# Altium project 6_Layer_Signal_Board.PrjPcb (part 2 of 2)

## Sheet AD.SchDoc
size A2; Organization: Protel International P/L; Address1: L3, 12a Rodborough Rd; Address2: Frenchs Forest; Address3: NSW; Address4: Australia 2086
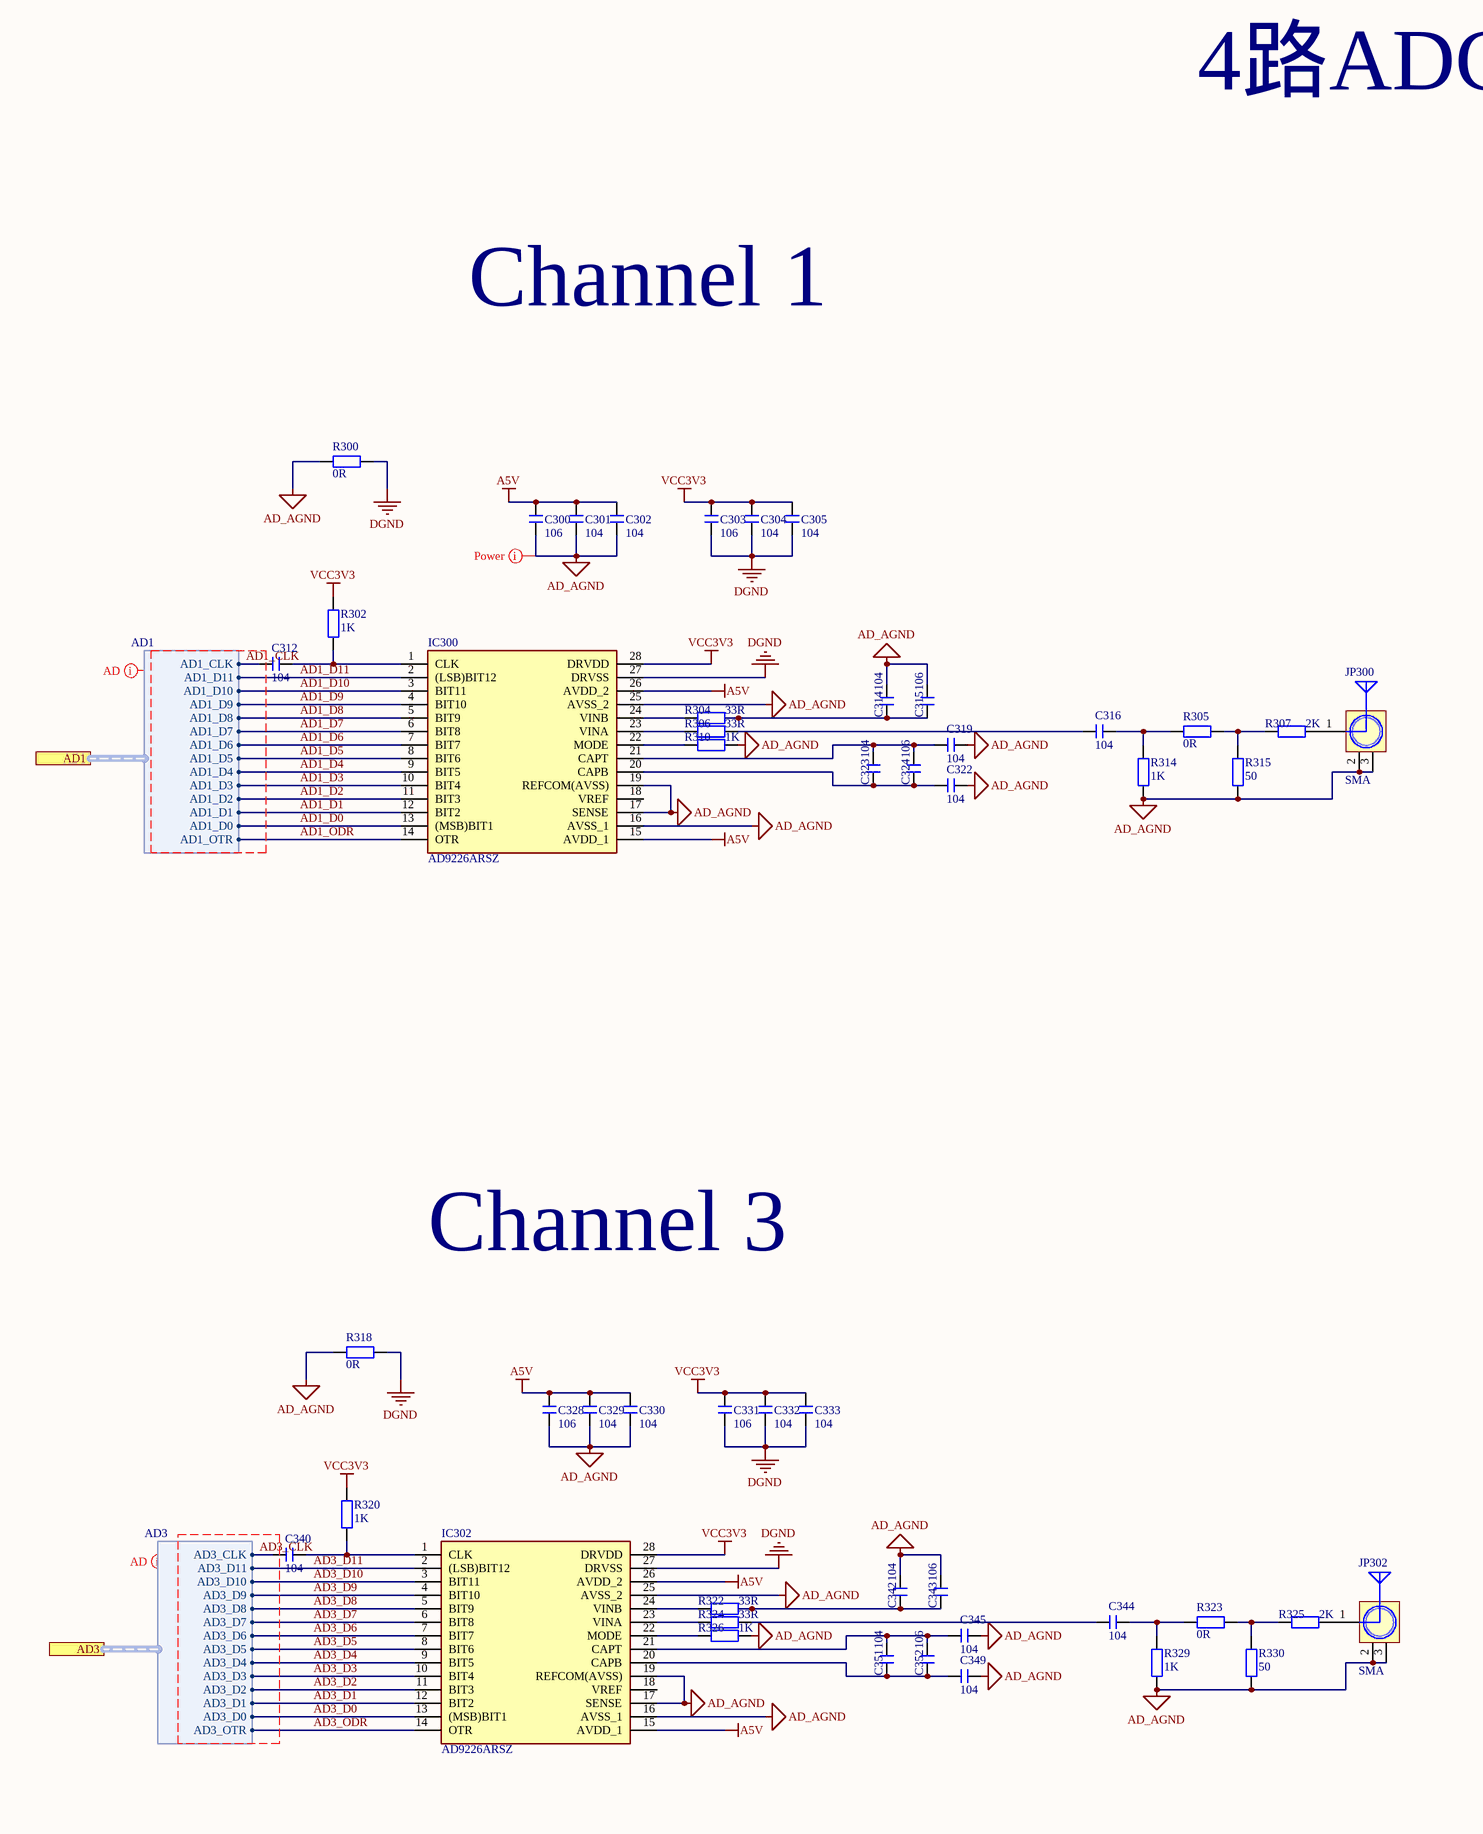
[diagram p11: AD.SchDoc, left]
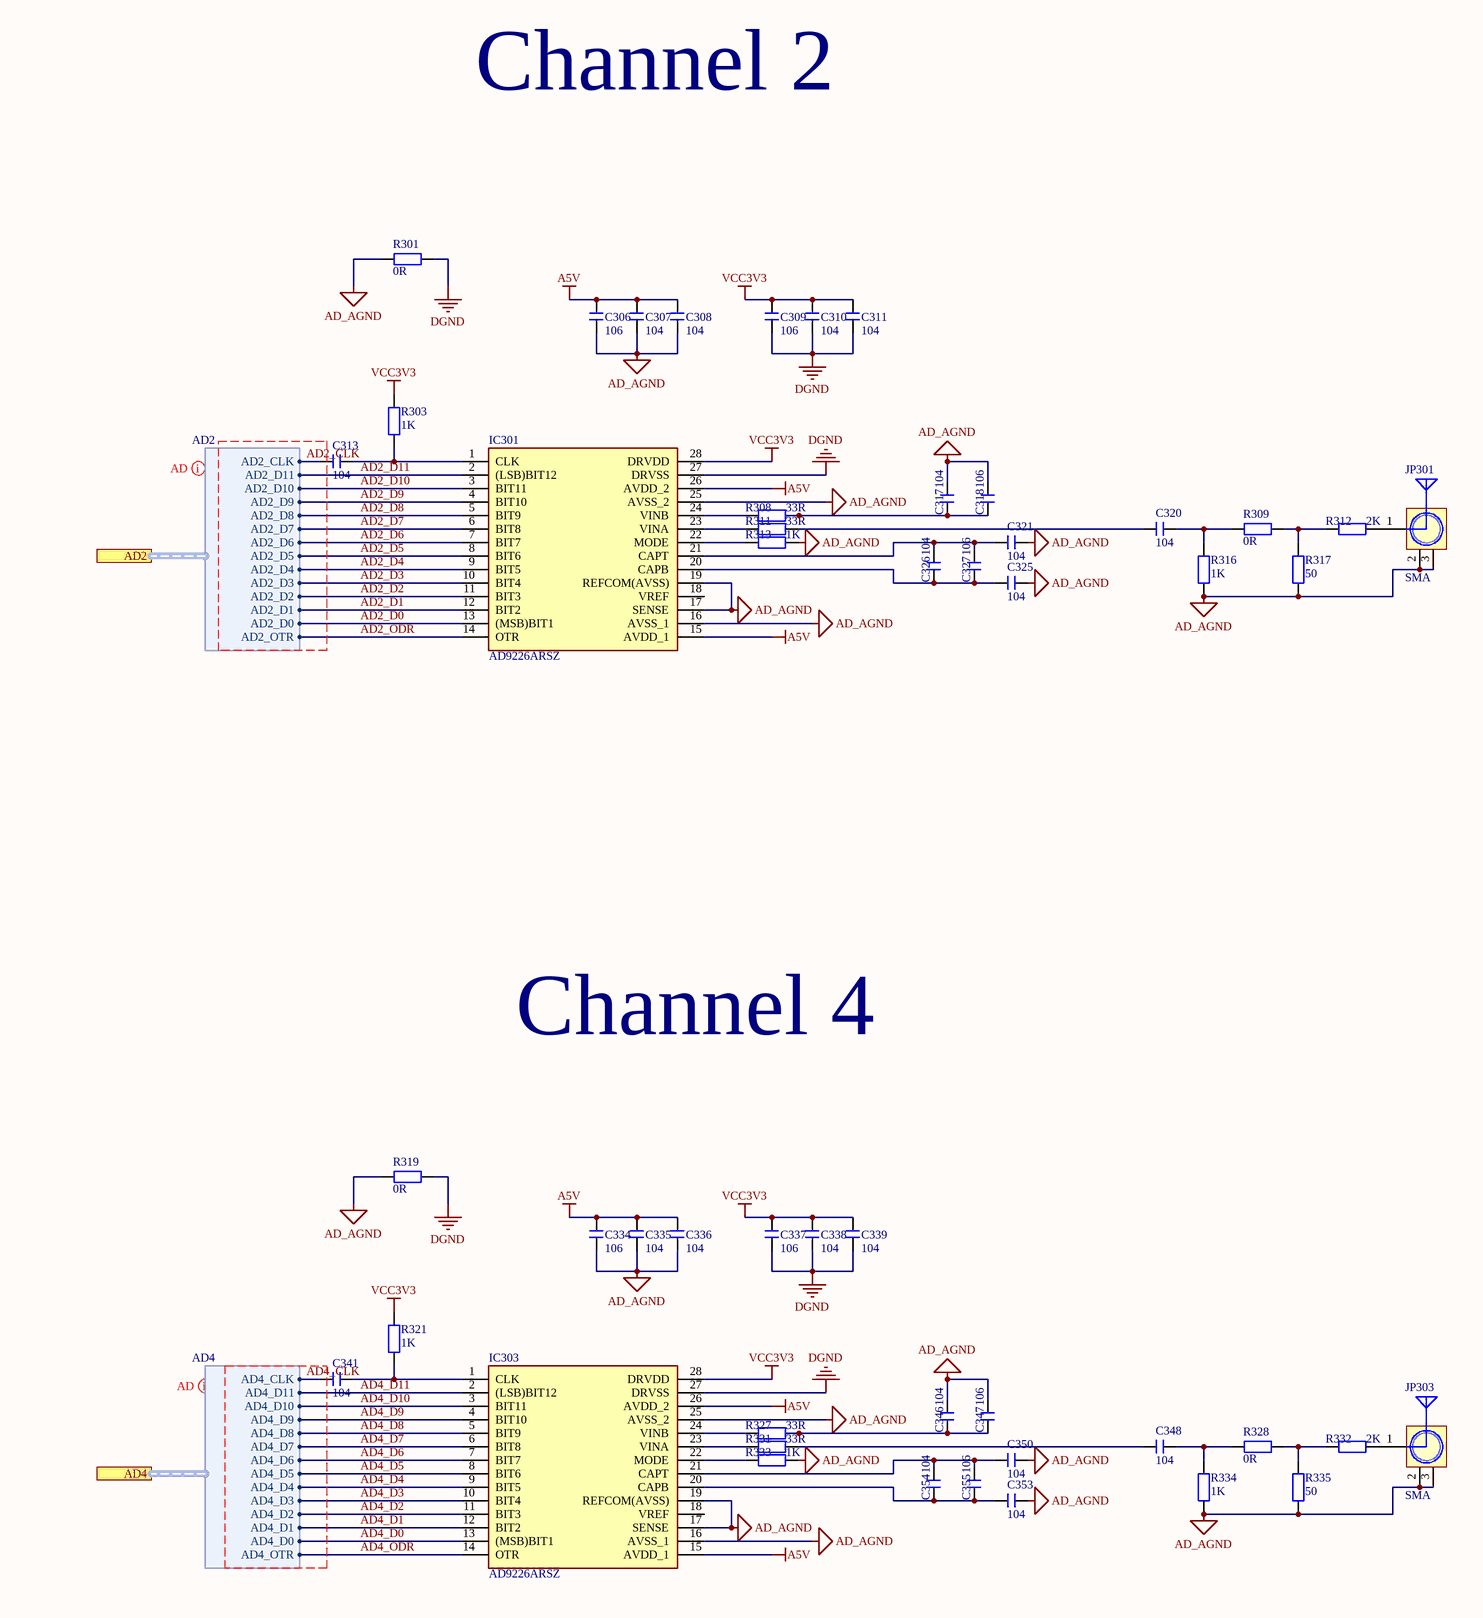
[diagram p12: AD.SchDoc, right]

### Parts
C300  106  [C 0402_M]
C301  104  [C 0402_M]
C302  104  [C 0402_M]
C303  106  [C 0402_M]
C304  104  [C 0402_M]
C305  104  [C 0402_M]
C306  106  [C 0402_M]
C307  104  [C 0402_M]
C308  104  [C 0402_M]
C309  106  [C 0402_M]
C310  104  [C 0402_M]
C311  104  [C 0402_M]
C312  104  [C 0402_M]
C313  104  [C 0402_M]
C314  104  [C 0402_M]
C315  106  [C 0402_M]
C316  104  [C 0402_M]
C317  104  [C 0402_M]
C318  106  [C 0402_M]
C319  104  [C 0402_M]
C320  104  [C 0402_M]
C321  104  [C 0402_M]
C322  104  [C 0402_M]
C323  104  [C 0402_M]
C324  106  [C 0402_M]
C325  104  [C 0402_M]
C326  104  [C 0402_M]
C327  106  [C 0402_M]
C328  106  [C 0402_M]
C329  104  [C 0402_M]
C330  104  [C 0402_M]
C331  106  [C 0402_M]
C332  104  [C 0402_M]
C333  104  [C 0402_M]
C334  106  [C 0402_M]
C335  104  [C 0402_M]
C336  104  [C 0402_M]
C337  106  [C 0402_M]
C338  104  [C 0402_M]
C339  104  [C 0402_M]
C340  104  [C 0402_M]
C341  104  [C 0402_M]
C342  104  [C 0402_M]
C343  106  [C 0402_M]
C344  104  [C 0402_M]
C345  104  [C 0402_M]
C346  104  [C 0402_M]
C347  106  [C 0402_M]
C348  104  [C 0402_M]
C349  104  [C 0402_M]
C350  104  [C 0402_M]
C351  104  [C 0402_M]
C352  106  [C 0402_M]
C353  104  [C 0402_M]
C354  104  [C 0402_M]
C355  106  [C 0402_M]
IC300  AD9226ARSZ  [SOP65P777X198-28N]
IC301  AD9226ARSZ  [SOP65P777X198-28N]
IC302  AD9226ARSZ  [SOP65P777X198-28N]
IC303  AD9226ARSZ  [SOP65P777X198-28N]
JP300  SMA  [SMA_FR]
JP301  SMA  [SMA_FR]
JP302  SMA  [SMA_FR]
JP303  SMA  [SMA_FR]
R300  0R  [R 0402_M]
R301  0R  [R 0402_M]
R302  1K  [R 0402_M]
R303  1K  [R 0402_M]
R304  33R  [R 0402_M]
R305  0R  [R 0402_M]
R306  33R  [R 0402_M]
R307  2K  [R 0402_M]
R308  33R  [R 0402_M]
R309  0R  [R 0402_M]
R310  1K  [R 0402_M]
R311  33R  [R 0402_M]
R312  2K  [R 0402_M]
R313  1K  [R 0402_M]
R314  1K  [R 0402_M]
R315  50  [R 0402_M]
R316  1K  [R 0402_M]
R317  50  [R 0402_M]
R318  0R  [R 0402_M]
R319  0R  [R 0402_M]
R320  1K  [R 0402_M]
R321  1K  [R 0402_M]
R322  33R  [R 0402_M]
R323  0R  [R 0402_M]
R324  33R  [R 0402_M]
R325  2K  [R 0402_M]
R326  1K  [R 0402_M]
R327  33R  [R 0402_M]
R328  0R  [R 0402_M]
R329  1K  [R 0402_M]
R330  50  [R 0402_M]
R331  33R  [R 0402_M]
R332  2K  [R 0402_M]
R333  1K  [R 0402_M]
R334  1K  [R 0402_M]
R335  50  [R 0402_M]

### Ports
AD1 (harness AD1), AD2 (harness AD2), AD3 (harness AD3), AD4 (harness AD4)

### Harnesses
AD1: AD1_CLK, AD1_D11, AD1_D10, AD1_D9, AD1_D8, AD1_D7, AD1_D6, AD1_D5, AD1_D4, AD1_D3, AD1_D2, AD1_D1, AD1_D0, AD1_OTR
AD2: AD2_CLK, AD2_D11, AD2_D10, AD2_D9, AD2_D8, AD2_D7, AD2_D6, AD2_D5, AD2_D4, AD2_D3, AD2_D2, AD2_D1, AD2_D0, AD2_OTR
AD3: AD3_CLK, AD3_D11, AD3_D10, AD3_D9, AD3_D8, AD3_D7, AD3_D6, AD3_D5, AD3_D4, AD3_D3, AD3_D2, AD3_D1, AD3_D0, AD3_OTR
AD4: AD4_CLK, AD4_D11, AD4_D10, AD4_D9, AD4_D8, AD4_D7, AD4_D6, AD4_D5, AD4_D4, AD4_D3, AD4_D2, AD4_D1, AD4_D0, AD4_OTR

### Nets
A5V: C300.1 C301.1 C302.1 C306.1 C307.1 C308.1 C328.1 C329.1 C330.1 C334.1 C335.1 C336.1 IC300.15(AVDD_1) IC300.26(AVDD_2) IC301.15(AVDD_1) IC301.26(AVDD_2) IC302.15(AVDD_1) IC302.26(AVDD_2) IC303.15(AVDD_1) IC303.26(AVDD_2)
AD_AGND: C300.2 C301.2 C302.2 C306.2 C307.2 C308.2 C314.2 C315.2 C317.2 C318.2 C319.1 C321.1 C322.1 C325.1 C328.2 C329.2 C330.2 C334.2 C335.2 C336.2 C342.2 C343.2 C345.1 C346.2 C347.2 C349.1 C350.1 C353.1 IC300.16(AVSS_1) IC300.17(SENSE) IC300.19(REFCOM(AVSS)) IC300.25(AVSS_2) IC301.16(AVSS_1) IC301.17(SENSE) IC301.19(REFCOM(AVSS)) IC301.25(AVSS_2) IC302.16(AVSS_1) IC302.17(SENSE) IC302.19(REFCOM(AVSS)) IC302.25(AVSS_2) IC303.16(AVSS_1) IC303.17(SENSE) IC303.19(REFCOM(AVSS)) IC303.25(AVSS_2) JP300.2(GND) JP300.3(GND) JP301.2(GND) JP301.3(GND) JP302.2(GND) JP302.3(GND) JP303.2(GND) JP303.3(GND) R300.1 R301.1 R310.2 R313.2 R314.1 R315.1 R316.1 R317.1 R318.1 R319.1 R326.2 R329.1 R330.1 R333.2 R334.1 R335.1
DGND: C303.2 C304.2 C305.2 C309.2 C310.2 C311.2 C331.2 C332.2 C333.2 C337.2 C338.2 C339.2 IC300.27(DRVSS) IC301.27(DRVSS) IC302.27(DRVSS) IC303.27(DRVSS) R300.2 R301.2 R318.2 R319.2
VCC3V3: C303.1 C304.1 C305.1 C309.1 C310.1 C311.1 C331.1 C332.1 C333.1 C337.1 C338.1 C339.1 IC300.28(DRVDD) IC301.28(DRVDD) IC302.28(DRVDD) IC303.28(DRVDD) R302.1 R303.1 R320.1 R321.1
AD1_CLK: C312.2 ; port AD1.AD1_CLK
AD1_D0: IC300.13((MSB)BIT1) ; port AD1.AD1_D0
AD1_D1: IC300.12(BIT2) ; port AD1.AD1_D1
AD1_D2: IC300.11(BIT3) ; port AD1.AD1_D2
AD1_D3: IC300.10(BIT4) ; port AD1.AD1_D3
AD1_D4: IC300.9(BIT5) ; port AD1.AD1_D4
AD1_D5: IC300.8(BIT6) ; port AD1.AD1_D5
AD1_D6: IC300.7(BIT7) ; port AD1.AD1_D6
AD1_D7: IC300.6(BIT8) ; port AD1.AD1_D7
AD1_D8: IC300.5(BIT9) ; port AD1.AD1_D8
AD1_D9: IC300.4(BIT10) ; port AD1.AD1_D9
AD1_D10: IC300.3(BIT11) ; port AD1.AD1_D10
AD1_D11: IC300.2((LSB)BIT12) ; port AD1.AD1_D11
AD1_ODR: IC300.14(OTR) ; port AD1.AD1_OTR
AD2_CLK: C313.2 ; port AD2.AD2_CLK
AD2_D0: IC301.13((MSB)BIT1) ; port AD2.AD2_D0
AD2_D1: IC301.12(BIT2) ; port AD2.AD2_D1
AD2_D2: IC301.11(BIT3) ; port AD2.AD2_D2
AD2_D3: IC301.10(BIT4) ; port AD2.AD2_D3
AD2_D4: IC301.9(BIT5) ; port AD2.AD2_D4
AD2_D5: IC301.8(BIT6) ; port AD2.AD2_D5
AD2_D6: IC301.7(BIT7) ; port AD2.AD2_D6
AD2_D7: IC301.6(BIT8) ; port AD2.AD2_D7
AD2_D8: IC301.5(BIT9) ; port AD2.AD2_D8
AD2_D9: IC301.4(BIT10) ; port AD2.AD2_D9
AD2_D10: IC301.3(BIT11) ; port AD2.AD2_D10
AD2_D11: IC301.2((LSB)BIT12) ; port AD2.AD2_D11
AD2_ODR: IC301.14(OTR) ; port AD2.AD2_OTR
AD3_CLK: C340.2 ; port AD3.AD3_CLK
AD3_D0: IC302.13((MSB)BIT1) ; port AD3.AD3_D0
AD3_D1: IC302.12(BIT2) ; port AD3.AD3_D1
AD3_D2: IC302.11(BIT3) ; port AD3.AD3_D2
AD3_D3: IC302.10(BIT4) ; port AD3.AD3_D3
AD3_D4: IC302.9(BIT5) ; port AD3.AD3_D4
AD3_D5: IC302.8(BIT6) ; port AD3.AD3_D5
AD3_D6: IC302.7(BIT7) ; port AD3.AD3_D6
AD3_D7: IC302.6(BIT8) ; port AD3.AD3_D7
AD3_D8: IC302.5(BIT9) ; port AD3.AD3_D8
AD3_D9: IC302.4(BIT10) ; port AD3.AD3_D9
AD3_D10: IC302.3(BIT11) ; port AD3.AD3_D10
AD3_D11: IC302.2((LSB)BIT12) ; port AD3.AD3_D11
AD3_ODR: IC302.14(OTR) ; port AD3.AD3_OTR
AD4_CLK: C341.2 ; port AD4.AD4_CLK
AD4_D0: IC303.13((MSB)BIT1) ; port AD4.AD4_D0
AD4_D1: IC303.12(BIT2) ; port AD4.AD4_D1
AD4_D2: IC303.11(BIT3) ; port AD4.AD4_D2
AD4_D3: IC303.10(BIT4) ; port AD4.AD4_D3
AD4_D4: IC303.9(BIT5) ; port AD4.AD4_D4
AD4_D5: IC303.8(BIT6) ; port AD4.AD4_D5
AD4_D6: IC303.7(BIT7) ; port AD4.AD4_D6
AD4_D7: IC303.6(BIT8) ; port AD4.AD4_D7
AD4_D8: IC303.5(BIT9) ; port AD4.AD4_D8
AD4_D9: IC303.4(BIT10) ; port AD4.AD4_D9
AD4_D10: IC303.3(BIT11) ; port AD4.AD4_D10
AD4_D11: IC303.2((LSB)BIT12) ; port AD4.AD4_D11
AD4_ODR: IC303.14(OTR) ; port AD4.AD4_OTR
NetC312_1: C312.1 IC300.1(CLK) R302.2
NetC313_1: C313.1 IC301.1(CLK) R303.2
NetC314_1: C314.1 C315.1 R304.2
NetC316_1: C316.1 R305.2 R314.2
NetC316_2: C316.2 R306.2
NetC317_1: C317.1 C318.1 R308.2
NetC319_2: C319.2 C323.2 C324.2 IC300.21(CAPT)
NetC320_1: C320.1 R309.2 R316.2
NetC320_2: C320.2 R311.2
NetC321_2: C321.2 C326.2 C327.2 IC301.21(CAPT)
NetC322_2: C322.2 C323.1 C324.1 IC300.20(CAPB)
NetC325_2: C325.2 C326.1 C327.1 IC301.20(CAPB)
NetC340_1: C340.1 IC302.1(CLK) R320.2
NetC341_1: C341.1 IC303.1(CLK) R321.2
NetC342_1: C342.1 C343.1 R322.2
NetC344_1: C344.1 R323.2 R329.2
NetC344_2: C344.2 R324.2
NetC345_2: C345.2 C351.2 C352.2 IC302.21(CAPT)
NetC346_1: C346.1 C347.1 R327.2
NetC348_1: C348.1 R328.2 R334.2
NetC348_2: C348.2 R331.2
NetC349_2: C349.2 C351.1 C352.1 IC302.20(CAPB)
NetC350_2: C350.2 C354.2 C355.2 IC303.21(CAPT)
NetC353_2: C353.2 C354.1 C355.1 IC303.20(CAPB)
NetIC300_22: IC300.22(MODE) R310.1
NetIC300_23: IC300.23(VINA) R306.1
NetIC300_24: IC300.24(VINB) R304.1
NetIC301_22: IC301.22(MODE) R313.1
NetIC301_23: IC301.23(VINA) R311.1
NetIC301_24: IC301.24(VINB) R308.1
NetIC302_22: IC302.22(MODE) R326.1
NetIC302_23: IC302.23(VINA) R324.1
NetIC302_24: IC302.24(VINB) R322.1
NetIC303_22: IC303.22(MODE) R333.1
NetIC303_23: IC303.23(VINA) R331.1
NetIC303_24: IC303.24(VINB) R327.1
NetJP300_1: JP300.1(ANT) R307.2
NetJP301_1: JP301.1(ANT) R312.2
NetJP302_1: JP302.1(ANT) R325.2
NetJP303_1: JP303.1(ANT) R332.2
NetR305_1: R305.1 R307.1 R315.2
NetR309_1: R309.1 R312.1 R317.2
NetR323_1: R323.1 R325.1 R330.2
NetR328_1: R328.1 R332.1 R335.2

Not connected (* = marked no-connect by the designer): IC300 18(VREF); IC301 18(VREF); IC302 18(VREF); IC303 18(VREF)

### Layout directives
net class Power: AD_AGND
net class AD1; rule Matched Net Lengths [Tolerance = 100mil]: AD1_CLK
net class AD2; rule Matched Net Lengths [Tolerance = 50mil]: AD2_CLK
net class AD3; rule Matched Net Lengths [Tolerance = 100mil]: AD3_CLK
net class AD4; rule Matched Net Lengths [Tolerance = 100mil]: AD4_CLK

### Notes on the sheet
- 4路ADC 48M
- Channel 1
- Channel 2
- Channel 3
- Channel 4
- Title
- Size:
- Date:
- File:
- A2
- Number:
- Time:
- Revision:
- Sheet
- of

### Library data of the parts
C300-C355 = C: 无极性贴片电容; 版权归属: 源创客; BOM名称: 无极性贴片电容; 学习资源: www.ooocke.com
IC300-IC303 = AD9226ARSZ: Integrated Circuit; Manufacturer_Name: Analog Devices; Datasheet Link: http://docs-emea.rs-online.com/webdocs/0501/0900766b80501af6.pdf; Height: 1.98mm; Manufacturer_Part_Number: AD9226ARSZ; Mouser Part Number: 584-AD9226ARSZ; Mouser Price/Stock: https://www.mouser.com/Search/Refine.aspx?Keyword=584-AD9226ARSZ; RS Part Number: 4973407P; RS Price/Stock: http://uk.rs-online.com/web/p/products/4973407P
JP300-JP303 = SMA: SMA-2.4G射频天线接口; 版权归属: 源创客; BOM名称: SMA-2.4G射频天线接口; 学习资源: www.ooocke.com
R300-R335 = R: 贴片电阻; 版权归属: 源创客; BOM名称: 贴片电阻; 学习资源: www.ooocke.com

## Sheet Driver.SchDoc
size A4; Organization: Protel International P/L; Address1: L3, 12a Rodborough Rd; Address2: Frenchs Forest; Address3: NSW; Address4: Australia 2086
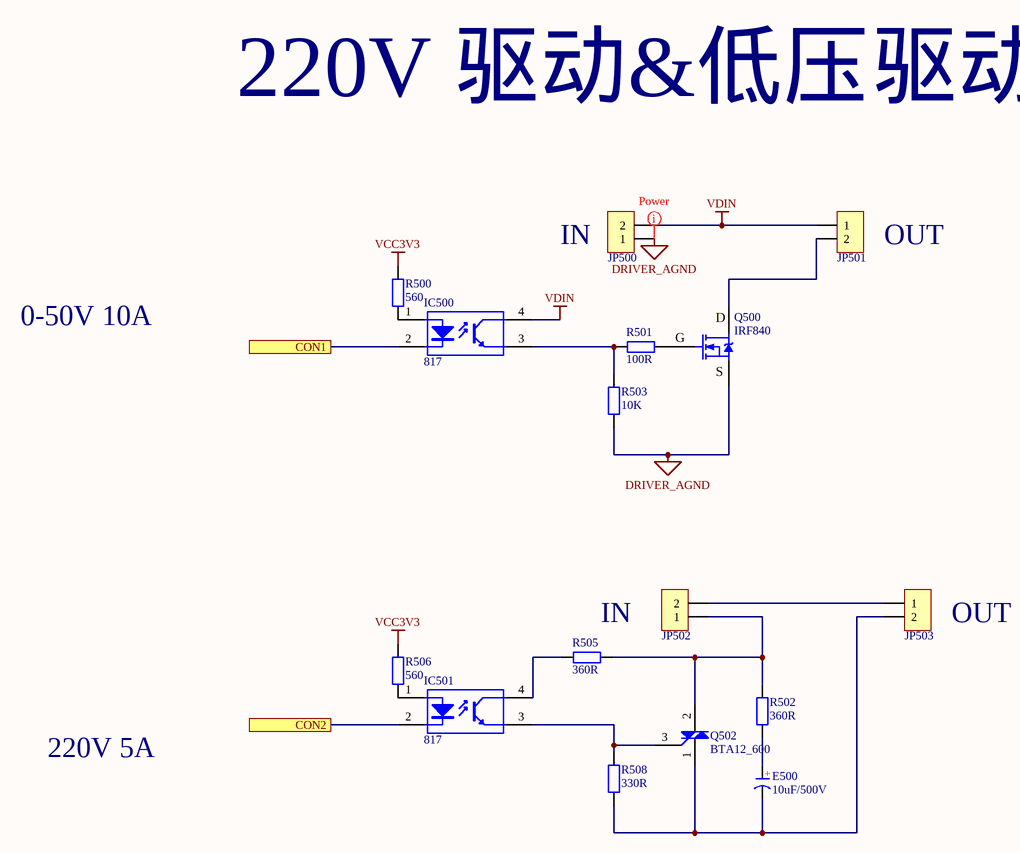
[diagram p13: Driver.SchDoc]

### Parts
E500  10uF/500V  [CS 2.0*5*8 - R]
IC500  817  [DIP4-300]
IC501  817  [DIP4-300]
JP500  HDR-1X2  [KF2EDGK5.0-LI-2P]  (value not drawn)
JP501  HDR-1X2  [KF2EDGK5.0-LI-2P]  (value not drawn)
JP502  HDR-1X2  [KF2EDGK5.0-LI-2P]  (value not drawn)
JP503  HDR-1X2  [KF2EDGK5.0-LI-2P]  (value not drawn)
Q500  IRF840  [TO220A]
Q502  BTA12_600  [TO252]
R500  560  [R 0402_M]
R501  100R  [R 0402_M]
R502  360R  [R 0402_M]
R503  10K  [R 0402_M]
R505  360R  [R 0402_M]
R506  560  [R 0402_M]
R508  330R  [R 0402_M]

### Ports
CON1, CON2

### Nets
DRIVER_AGND: JP500.1 Q500.3(S) R503.1
VCC3V3: R500.1 R506.1
VDIN: IC500.4(C) JP500.2 JP501.1
NetE500_1: E500.1(A) R502.2
NetE500_2: E500.2(K) JP503.2 Q502.1(A1) R508.1
NetIC500_1: IC500.1(A) R500.2
NetIC500_2: IC500.2(K) ; port CON1
NetIC500_3: IC500.3(E) R501.1 R503.2
NetIC501_1: IC501.1(A) R506.2
NetIC501_2: IC501.2(K) ; port CON2
NetIC501_3: IC501.3(E) Q502.3(G) R508.2
NetIC501_4: IC501.4(C) R505.2
NetJP501_2: JP501.2 Q500.2(D)
NetJP502_1: JP502.1 Q502.2(A2) R502.1 R505.1
NetJP502_2: JP502.2 JP503.1
NetQ500_1: Q500.1(G) R501.2

### Layout directives
net class Power: DRIVER_AGND

### Notes on the sheet
- 220V 驱动&低压驱动
- (near JP500) IN
- (near JP501) OUT
- 0-50V 10A
- (near R505) IN
- (near JP503) OUT
- 220V 5A
- Title
- Size:
- Date:
- A4
- Number:
- Time:
- Revision:
- Sheet
- of
- File:
- (in symbol C-CS) +

### Library data of the parts
E500 = C-CS: 直插固态电容; 版权归属: 源创客; BOM名称: 直插固态电容; 学习资源: www.ooocke.com
IC500 IC501 = 817: 线性光耦; 版权归属: 源创客; BOM名称: 线性光耦; 学习资源: www.ooocke.com
JP500 JP501 = Header 2: 2P接插件; 版权归属: 源创客; BOM名称: 2P接插件; 学习资源: www.ooocke.com
JP502 JP503 = Header 2: 2P接插件; pin to pad: 1>2 2>1; 版权归属: 源创客; BOM名称: 2P接插件; 学习资源: www.ooocke.com
Q500 = IRF840: N沟场效应管; 版权归属: 源创客; BOM名称: N沟场效应管; 学习资源: www.ooocke.com
Q502 = BTA12_600: 双向可控硅; 版权归属: 源创客; BOM名称: 双向可控硅; 学习资源: www.ooocke.com
R500-R503 R505 R506 R508 = R: 贴片电阻; 版权归属: 源创客; BOM名称: 贴片电阻; 学习资源: www.ooocke.com

## Sheet WiFi.SchDoc
size A4; Organization: Protel International P/L; Address1: L3, 12a Rodborough Rd; Address2: Frenchs Forest; Address3: NSW; Address4: Australia 2086
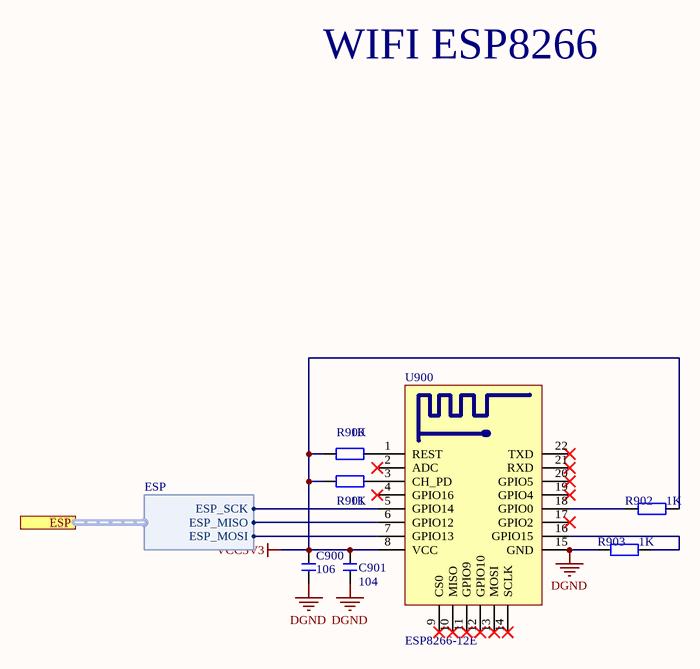
[diagram p14: WiFi.SchDoc]

### Parts
C900  106  [C 0402_M]
C901  104  [C 0402_M]
R900  1K  [R 0402_M]
R901  1K  [R 0402_M]
R902  1K  [R 0402_M]
R903  1K  [R 0402_M]
U900  ESP8266-12E  [ESP_12E]

### Ports
ESP (harness ESP)

### Harnesses
ESP: ESP_SCK, ESP_MISO, ESP_MOSI

### Nets
DGND: C900.1 C901.1 R903.1 U900.15(GND)
VCC3V3: C900.2 C901.2 R900.1 R901.1 R902.2 U900.8(VCC)
ESP_MISO: U900.6(GPIO12) ; port ESP.ESP_MISO
ESP_MOSI: U900.7(GPIO13) ; port ESP.ESP_MOSI
ESP_SCK: U900.5(GPIO14) ; port ESP.ESP_SCK
NetR900_2: R900.2 U900.1(REST)
NetR901_2: R901.2 U900.3(CH_PD)
NetR902_1: R902.1 U900.18(GPIO0)
NetR903_2: R903.2 U900.16(GPIO15)

Not connected (* = marked no-connect by the designer): U900 2(ADC)* 4(GPIO16)* 9(CS0)* 10(MISO)* 11(GPIO9)* 12(GPIO10)* 13(MOSI)* 14(SCLK)* 17(GPIO2)* 19(GPIO4)* 20(GPIO5)* 21(RXD)* 22(TXD)*

### Notes on the sheet
- WIFI ESP8266
- Title
- Size:
- Date:
- A4
- Number:
- Time:
- Revision:
- Sheet
- of
- File:

### Library data of the parts
C900 C901 = C: 无极性贴片电容; 版权归属: 源创客; BOM名称: 无极性贴片电容; 学习资源: www.ooocke.com
R900-R903 = R: 贴片电阻; 版权归属: 源创客; BOM名称: 贴片电阻; 学习资源: www.ooocke.com
U900 = ESP8266-12E: 串口 WIFI模块，ESP-12E; BOM名称: WIFI模块; 版权归属: 源创客; 学习资源: www.ooocke.com

## Sheet EEPROM_FLASH.SchDoc
size A4; Organization: Protel International P/L; Address1: L3, 12a Rodborough Rd; Address2: Frenchs Forest; Address3: NSW; Address4: Australia 2086
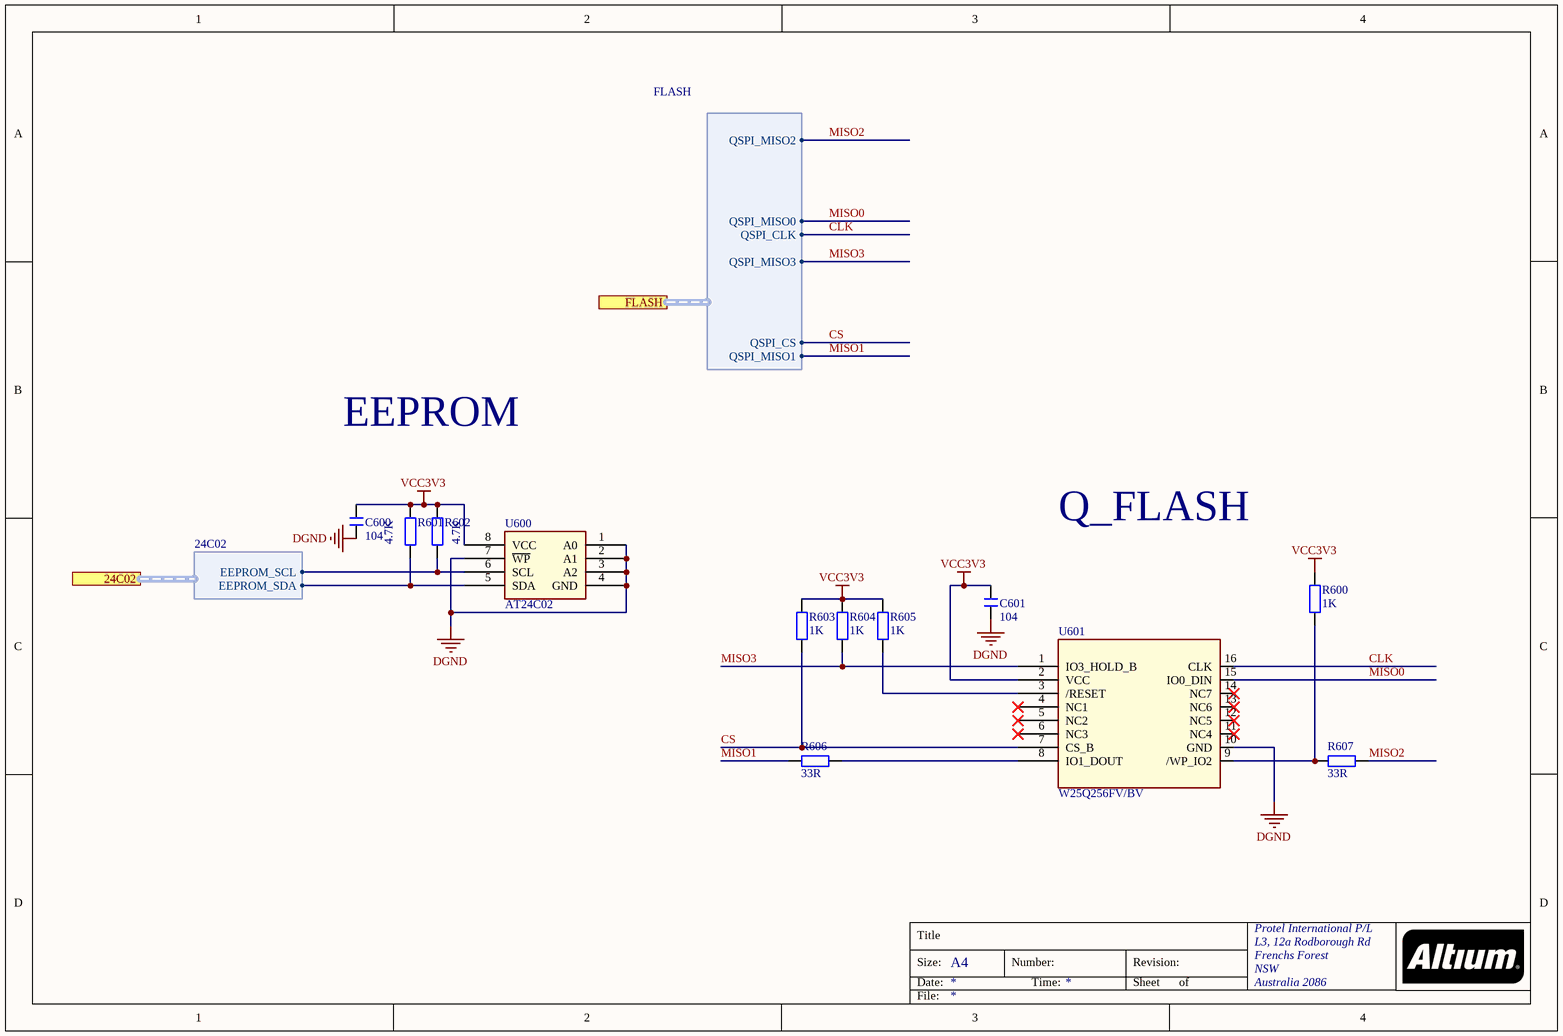
[diagram p15: EEPROM_FLASH.SchDoc]

### Parts
C600  104  [C 0402_M]
C601  104  [C 0402_M]
R600  1K  [R 0402_M]
R601  4.7K  [R 0402_M]
R602  4.7K  [R 0402_M]
R603  1K  [R 0402_M]
R604  1K  [R 0402_M]
R605  1K  [R 0402_M]
R606  33R  [R 0402_M]
R607  33R  [R 0402_M]
U600  AT24C02  [SOP8_M]
U601  W25Q256FV/BV  [SOP16W_M]

### Ports
24C02 (harness 24C02), FLASH (harness FLASH)

### Harnesses
24C02: EEPROM_SCL, EEPROM_SDA
FLASH: QSPI_MISO3, QSPI_CS, QSPI_MISO1, QSPI_CLK, QSPI_MISO0, QSPI_MISO2

### Nets
DGND: C600.1 C601.1 U600.1(A0) U600.2(A1) U600.3(A2) U600.4(GND) U600.7(~{WP}) U601.10(GND)
VCC3V3: C600.2 C601.2 R600.2 R601.2 R602.2 R603.2 R604.2 R605.2 U600.8(VCC) U601.2(VCC)
CLK: U601.16(CLK) ; port FLASH.QSPI_CLK
CS: R603.1 U601.7(CS_B) ; port FLASH.QSPI_CS
MISO0: U601.15(IO0_DIN) ; port FLASH.QSPI_MISO0
MISO1: R606.2 ; port FLASH.QSPI_MISO1
MISO2: R607.2 ; port FLASH.QSPI_MISO2
MISO3: R604.1 U601.1(IO3_HOLD_B) ; port FLASH.QSPI_MISO3
NetR600_1: R600.1 R607.1 U601.9(/WP_IO2)
NetR601_1: R601.1 U600.5(SDA) ; port 24C02.EEPROM_SDA
NetR602_1: R602.1 U600.6(SCL) ; port 24C02.EEPROM_SCL
NetR605_1: R605.1 U601.3(/RESET)
NetR606_1: R606.1 U601.8(IO1_DOUT)

Not connected (* = marked no-connect by the designer): U601 4(NC1)* 5(NC2)* 6(NC3)* 11(NC4)* 12(NC5)* 13(NC6)* 14(NC7)*

### Notes on the sheet
- EEPROM
- Q_FLASH
- Title
- Size:
- Date:
- A4
- Number:
- Time:
- Revision:
- Sheet
- of
- File:

### Library data of the parts
C600 C601 = C: 无极性贴片电容; 版权归属: 源创客; BOM名称: 无极性贴片电容; 学习资源: www.ooocke.com
R600-R607 = R: 贴片电阻; 版权归属: 源创客; BOM名称: 贴片电阻; 学习资源: www.ooocke.com

## Sheet VGA.SchDoc
size A3; Organization: Protel International P/L; Address1: L3, 12a Rodborough Rd; Address2: Frenchs Forest; Address3: NSW; Address4: Australia 2086
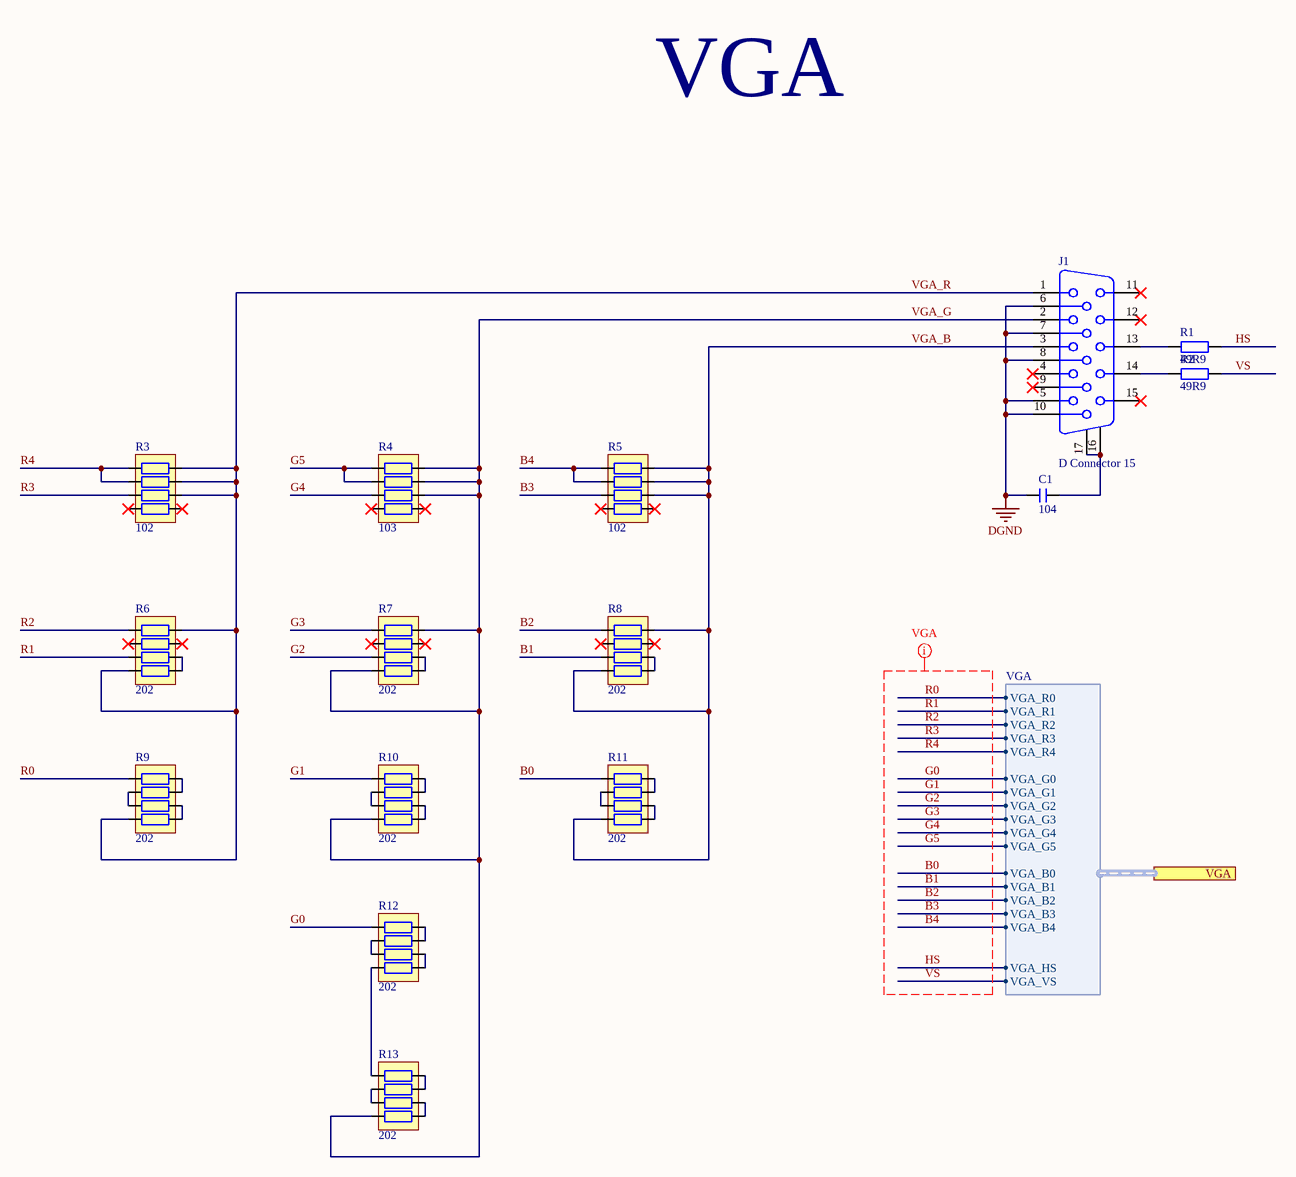
[diagram p16: VGA.SchDoc]

### Parts
C1  104  [C 0402_M]
J1  D Connector 15  [VGA15b]
R1  49R9  [R 0402_M]
R2  49R9  [R 0402_M]
R3  102  [RCA-8P4R-0402]
R4  103  [RCA-8P4R-0402]
R5  102  [RCA-8P4R-0402]
R6  202  [RCA-8P4R-0402]
R7  202  [RCA-8P4R-0402]
R8  202  [RCA-8P4R-0402]
R9  202  [RCA-8P4R-0402]
R10  202  [RCA-8P4R-0402]
R11  202  [RCA-8P4R-0402]
R12  202  [RCA-8P4R-0402]
R13  202  [RCA-8P4R-0402]

### Ports
VGA (harness VGA)

### Harnesses
VGA: VGA_R0, VGA_R1, VGA_R2, VGA_R3, VGA_R4, VGA_G0, VGA_G1, VGA_G2, VGA_G3, VGA_G4, VGA_G5, VGA_B0, VGA_B1, VGA_B2, VGA_B3, VGA_B4, VGA_HS, VGA_VS

### Nets
DGND: C1.1 J1.5 J1.6 J1.7 J1.8 J1.10
B0: R11.1 ; port VGA.VGA_B0
B1: R8.3 ; port VGA.VGA_B1
B2: R8.1 ; port VGA.VGA_B2
B3: R5.3 ; port VGA.VGA_B3
B4: R5.1 R5.2 ; port VGA.VGA_B4
G0: R12.1 ; port VGA.VGA_G0
G1: R10.1 ; port VGA.VGA_G1
G2: R7.3 ; port VGA.VGA_G2
G3: R7.1 ; port VGA.VGA_G3
G4: R4.3 ; port VGA.VGA_G4
G5: R4.1 R4.2 ; port VGA.VGA_G5
HS: R1.1 ; port VGA.VGA_HS
R0: R9.1 ; port VGA.VGA_R0
R1: R6.3 ; port VGA.VGA_R1
R2: R6.1 ; port VGA.VGA_R2
R3: R3.3 ; port VGA.VGA_R3
R4: R3.1 R3.2 ; port VGA.VGA_R4
VGA_B: J1.3 R5.6 R5.7 R5.8 R8.4 R8.8 R11.4
VGA_G: J1.2 R4.6 R4.7 R4.8 R7.4 R7.8 R10.4 R13.4
VGA_R: J1.1 R3.6 R3.7 R3.8 R6.4 R6.8 R9.4
VS: R2.1 ; port VGA.VGA_VS  [project net VGA_VS]
NetC1_2: C1.2 J1.16(MH2) J1.17(MH1)
NetJ1_13: J1.13 R1.2
NetJ1_14: J1.14 R2.2
NetR6_5: R6.5 R6.6
NetR7_5: R7.5 R7.6
NetR8_5: R8.5 R8.6
NetR9_2: R9.2 R9.3
NetR9_5: R9.5 R9.6
NetR9_7: R9.7 R9.8
NetR10_2: R10.2 R10.3
NetR10_5: R10.5 R10.6
NetR10_7: R10.7 R10.8
NetR11_2: R11.2 R11.3
NetR11_5: R11.5 R11.6
NetR11_7: R11.7 R11.8
NetR12_2: R12.2 R12.3
NetR12_4: R12.4 R13.1
NetR12_5: R12.5 R12.6
NetR12_7: R12.7 R12.8
NetR13_2: R13.2 R13.3
NetR13_5: R13.5 R13.6
NetR13_7: R13.7 R13.8

Not connected (* = marked no-connect by the designer): J1 4* 9* 11* 12* 15*; R3 4* 5*; R4 4* 5*; R5 4* 5*; R6 2* 7*; R7 2* 7*; R8 2* 7*

### Layout directives
rule Matched Net Lengths [Tolerance = 100mil]; net class VGA: B0, B1, B2, B3, B4, G0, G1, G2, G3, G4, G5, HS, R0, R1, R2, R3, R4, VS

### Notes on the sheet
- VGA
- Title
- Size:
- Date:
- A3
- Number:
- Time:
- Revision:
- Sheet
- of
- File:

### Library data of the parts
C1 = C: 无极性贴片电容; 版权归属: 源创客; BOM名称: 无极性贴片电容; 学习资源: www.ooocke.com
J1 = D Connector 15: VGA通讯端口; 版权归属: 源创客; 学习资源: www.ooocke.com; BOM名称: VGA通讯端口
R1 R2 = R: 贴片电阻; 版权归属: 源创客; BOM名称: 贴片电阻; 学习资源: www.ooocke.com
R3-R13 = R-8P4R: 贴片网络排阻; 版权归属: 源创客; BOM名称: 贴片网络排阻; 学习资源: www.ooocke.com

## Nets that join several sheets
A5V: Power (C726.2 C727.2 C728.2 V700.3), AD (20 pins)
AD_AGND: Power (7 pins), AD (68 pins)
DDR3_VREF: FPGA (C100.2 U100.C1 U100.M5 U100.N3), DDR3 RAM (6 pins)
DGND: FPGA (87 pins), Power (40 pins), 1G Eternet (34 pins), USB2.0 (22 pins), DDR3 RAM (62 pins), AD (20 pins), WiFi (C900.1 C901.1 R903.1 U900.15), EEPROM_FLASH (8 pins), VGA (6 pins)
VCC1V2: FPGA (17 pins), Power (8 pins)
VCC1V5: FPGA (13 pins), Power (8 pins), DDR3 RAM (33 pins)
VCC3V3: FPGA (58 pins), Power (8 pins), 1G Eternet (28 pins), USB2.0 (19 pins), DDR3 RAM (C212.2 R229.2 R230.2 U201.10), AD (20 pins), Driver (R500.1 R506.1), WiFi (6 pins), EEPROM_FLASH (10 pins)
A0: FPGA (U100.F6), DDR3 RAM (R200.2 U200.N3)
A1: FPGA (U100.J6), DDR3 RAM (R201.2 U200.P7)
A2: FPGA (U100.F5), DDR3 RAM (R202.2 U200.P3)
A3: FPGA (U100.D1), DDR3 RAM (R203.2 U200.N2)
A4: FPGA (U100.J7), DDR3 RAM (R204.2 U200.P8)
A5: FPGA (U100.D2), DDR3 RAM (R205.2 U200.P2)
A6: FPGA (U100.H6), DDR3 RAM (R206.2 U200.R8)
A7: FPGA (U100.D3), DDR3 RAM (R207.2 U200.R2)
A8: FPGA (U100.H5), DDR3 RAM (R208.2 U200.T8)
A9: FPGA (U100.F4), DDR3 RAM (R209.2 U200.R3)
A10: FPGA (U100.L7), DDR3 RAM (R210.2 U200.L7)
A11: FPGA (U100.H3), DDR3 RAM (R211.2 U200.R7)
A12: FPGA (U100.G6), DDR3 RAM (R212.2 U200.N7)
A13: FPGA (U100.F3), DDR3 RAM (R213.2 U200.T3)
A14: FPGA (U100.H4), DDR3 RAM (R214.2 U200.T7)
AD1_CLK: FPGA (U100.R8), AD (C312.2)
AD1_D0: FPGA (U100.C15), AD (IC300.13)
AD1_D1: FPGA (U100.B16), AD (IC300.12)
AD1_D2: FPGA (U100.A16), AD (IC300.11)
AD1_D3: FPGA (U100.C14), AD (IC300.10)
AD1_D4: FPGA (U100.A15), AD (IC300.9)
AD1_D5: FPGA (U100.B14), AD (IC300.8)
AD1_D6: FPGA (U100.A14), AD (IC300.7)
AD1_D7: FPGA (U100.C13), AD (IC300.6)
AD1_D8: FPGA (U100.A13), AD (IC300.5)
AD1_D9: FPGA (U100.F13), AD (IC300.4)
AD1_D10: FPGA (U100.E12), AD (IC300.3)
AD1_D11: FPGA (U100.F12), AD (IC300.2)
AD1_ODR: FPGA (U100.D14), AD (IC300.14)
AD2_CLK: FPGA (U100.V9), AD (C313.2)
AD2_D0: FPGA (U100.U3), AD (IC301.13)
AD2_D1: FPGA (U100.V3), AD (IC301.12)
AD2_D2: FPGA (U100.T3), AD (IC301.11)
AD2_D3: FPGA (U100.V4), AD (IC301.10)
AD2_D4: FPGA (U100.T4), AD (IC301.9)
AD2_D5: FPGA (U100.V5), AD (IC301.8)
AD2_D6: FPGA (U100.U5), AD (IC301.7)
AD2_D7: FPGA (U100.V6), AD (IC301.6)
AD2_D8: FPGA (U100.T5), AD (IC301.5)
AD2_D9: FPGA (U100.V7), AD (IC301.4)
AD2_D10: FPGA (U100.R5), AD (IC301.3)
AD2_D11: FPGA (U100.V8), AD (IC301.2)
AD2_ODR: FPGA (U100.R3), AD (IC301.14)
AD3_CLK: FPGA (U100.T10), AD (C340.2)
AD3_D0: FPGA (U100.N5), AD (IC302.13)
AD3_D1: FPGA (U100.N6), AD (IC302.12)
AD3_D2: FPGA (U100.T6), AD (IC302.11)
AD3_D3: FPGA (U100.T7), AD (IC302.10)
AD3_D4: FPGA (U100.U7), AD (IC302.9)
AD3_D5: FPGA (U100.U8), AD (IC302.8)
AD3_D6: FPGA (U100.R7), AD (IC302.7)
AD3_D7: FPGA (U100.P6), AD (IC302.6)
AD3_D8: FPGA (U100.P7), AD (IC302.5)
AD3_D9: FPGA (U100.P8), AD (IC302.4)
AD3_D10: FPGA (U100.V10), AD (IC302.3)
AD3_D11: FPGA (U100.N8), AD (IC302.2)
AD3_ODR: FPGA (U100.N7), AD (IC302.14)
AD4_CLK: FPGA (U100.R15), AD (C341.2)
AD4_D0: FPGA (U100.M10), AD (IC303.13)
AD4_D1: FPGA (U100.N10), AD (IC303.12)
AD4_D2: FPGA (U100.R10), AD (IC303.11)
AD4_D3: FPGA (U100.T11), AD (IC303.10)
AD4_D4: FPGA (U100.U11), AD (IC303.9)
AD4_D5: FPGA (U100.V11), AD (IC303.8)
AD4_D6: FPGA (U100.R11), AD (IC303.7)
AD4_D7: FPGA (U100.V12), AD (IC303.6)
AD4_D8: FPGA (U100.T12), AD (IC303.5)
AD4_D9: FPGA (U100.P11), AD (IC303.4)
AD4_D10: FPGA (U100.N11), AD (IC303.3)
AD4_D11: FPGA (U100.M11), AD (IC303.2)
AD4_ODR: FPGA (U100.N9), AD (IC303.14)
B0: FPGA (U100.U17), VGA (R11.1)
B1: FPGA (U100.T18), VGA (R8.3)
B2: FPGA (U100.P17), VGA (R8.1)
B3: FPGA (U100.P18), VGA (R5.3)
B4: FPGA (U100.P16), VGA (R5.1 R5.2)
BA0: FPGA (U100.F2), DDR3 RAM (R216.2 U200.M2)
BA1: FPGA (U100.F1), DDR3 RAM (R217.2 U200.N8)
BA2: FPGA (U100.E1), DDR3 RAM (R218.2 U200.M3)
CAS_N: FPGA (U100.K5), DDR3 RAM (R221.2 U200.K3)
CKE: FPGA (U100.H7), DDR3 RAM (R223.2 U200.K9)
CLK: FPGA (U100.V15), EEPROM_FLASH (U601.16)
CLK_N: FPGA (U100.G1), DDR3 RAM (R215.1 U200.K7)
CLK_P: FPGA (U100.G3), DDR3 RAM (R215.2 U200.J7)
COL: FPGA (U100.H13), 1G Eternet (IC400.31 R411.1)
CRS: FPGA (U100.H14), 1G Eternet (IC400.32 R410.1)
CS: FPGA (U100.U15), EEPROM_FLASH (R603.1 U601.7)
DQ0: FPGA (U100.L2), DDR3 RAM (U200.G2)
DQ1: FPGA (U100.L1), DDR3 RAM (U200.F7)
DQ2: FPGA (U100.K2), DDR3 RAM (U200.E3)
DQ3: FPGA (U100.K1), DDR3 RAM (U200.F8)
DQ4: FPGA (U100.H2), DDR3 RAM (U200.H3)
DQ5: FPGA (U100.H1), DDR3 RAM (U200.H8)
DQ6: FPGA (U100.J3), DDR3 RAM (U200.H7)
DQ7: FPGA (U100.J1), DDR3 RAM (U200.F2)
DQ8: FPGA (U100.M3), DDR3 RAM (U200.A2)
DQ9: FPGA (U100.M1), DDR3 RAM (U200.A3)
DQ10: FPGA (U100.N2), DDR3 RAM (U200.C3)
DQ11: FPGA (U100.N1), DDR3 RAM (U200.C2)
DQ12: FPGA (U100.T2), DDR3 RAM (U200.B8)
DQ13: FPGA (U100.T1), DDR3 RAM (U200.A7)
DQ14: FPGA (U100.U2), DDR3 RAM (U200.D7)
DQ15: FPGA (U100.U1), DDR3 RAM (U200.C8)
ESP_MISO: FPGA (U100.A2), WiFi (U900.6)
ESP_MOSI: FPGA (U100.B2), WiFi (U900.7)
ESP_SCK: FPGA (U100.D6), WiFi (U900.5)
G0: FPGA (U100.U18), VGA (R12.1)
G1: FPGA (U100.T17), VGA (R10.1)
G2: FPGA (U100.L18), VGA (R7.3)
G3: FPGA (U100.N16), VGA (R7.1)
G4: FPGA (U100.P15), VGA (R4.3)
G5: FPGA (U100.N15), VGA (R4.1 R4.2)
GTXC: FPGA (U100.H15), 1G Eternet (IC400.34)
HS: FPGA (U100.L14), VGA (R1.1)
LDM: FPGA (U100.K3), DDR3 RAM (U200.E7)
LDQS_N: FPGA (U100.L3), DDR3 RAM (U200.G3)
LDQS_P: FPGA (U100.L4), DDR3 RAM (U200.F3)
MDC: FPGA (U100.L15), 1G Eternet (IC400.53)
MDIO: FPGA (U100.L16), 1G Eternet (IC400.54)
MISO0: FPGA (U100.T13), EEPROM_FLASH (U601.15)
MISO1: FPGA (U100.R13), EEPROM_FLASH (R606.2)
MISO2: FPGA (U100.T14), EEPROM_FLASH (R607.2)
MISO3: FPGA (U100.V14), EEPROM_FLASH (R604.1 U601.1)
NetIC500_2: FPGA (U100.V13), Driver (IC500.2)
NetIC501_2: FPGA (U100.U13), Driver (IC501.2)
NetR601_1: FPGA (U100.V16), EEPROM_FLASH (R601.1 U600.5)
NetR602_1: FPGA (U100.U16), EEPROM_FLASH (R602.1 U600.6)
ODT: FPGA (U100.K6), DDR3 RAM (R224.2 U200.K1)
R0: FPGA (U100.N18), VGA (R9.1)
R1: FPGA (U100.M18), VGA (R6.3)
R2: FPGA (U100.N17), VGA (R6.1)
R3: FPGA (U100.M14), VGA (R3.3)
R4: FPGA (U100.N14), VGA (R3.1 R3.2)
RAS_N: FPGA (U100.L5), DDR3 RAM (R220.2 U200.J3)
RESET: FPGA (U100.J16), 1G Eternet (IC400.38)
RESET_N: FPGA (U100.E4), DDR3 RAM (R225.2 U200.T2)
RXC: FPGA (U100.F18), 1G Eternet (R417.2)
RXD0: FPGA (U100.D18), 1G Eternet (R421.2)
RXD1: FPGA (U100.E16), 1G Eternet (R420.2)
RXD2: FPGA (U100.E18), 1G Eternet (R419.2)
RXD3: FPGA (U100.F17), 1G Eternet (R418.2)
RXD4: FPGA (U100.G13), 1G Eternet (R416.2 R424.1)
RXD5: FPGA (U100.G14), 1G Eternet (R415.2 R425.1)
RXD6: FPGA (U100.G16), 1G Eternet (R414.2 R426.1)
RXD7: FPGA (U100.G18), 1G Eternet (R413.2 R427.1)
RXDV: FPGA (U100.D17), 1G Eternet (R422.2 R423.1)
RXER: FPGA (U100.H12), 1G Eternet (R412.2 R429.1)
TXC: FPGA (U100.K14), 1G Eternet (IC400.42)
TXD0: FPGA (U100.J13), 1G Eternet (IC400.36)
TXD1: FPGA (U100.J18), 1G Eternet (IC400.39)
TXD2: FPGA (U100.K12), 1G Eternet (IC400.40)
TXD3: FPGA (U100.K13), 1G Eternet (IC400.41)
TXD4: FPGA (U100.K15), 1G Eternet (IC400.43)
TXD5: FPGA (U100.K16), 1G Eternet (IC400.44)
TXD6: FPGA (U100.K17), 1G Eternet (IC400.45)
TXD7: FPGA (U100.L12), 1G Eternet (IC400.46)
TXEN: FPGA (U100.H16), 1G Eternet (IC400.35)
TXER: FPGA (U100.L13), 1G Eternet (IC400.47)
UDM: FPGA (U100.K4), DDR3 RAM (U200.D3)
UDQS_N: FPGA (U100.P1), DDR3 RAM (U200.B7)
UDQS_P: FPGA (U100.P2), DDR3 RAM (U200.C7)
USB_CLK_N: FPGA (U100.C9), USB2.0 (U800.13)
USB_CLK_P: FPGA (U100.D9), USB2.0 (U800.54)
USB_FD0: FPGA (U100.G9), USB2.0 (U800.18)
USB_FD1: FPGA (U100.C6), USB2.0 (U800.19)
USB_FD2: FPGA (U100.F9), USB2.0 (U800.20)
USB_FD3: FPGA (U100.A3), USB2.0 (U800.21)
USB_FD4: FPGA (U100.D8), USB2.0 (U800.22)
USB_FD5: FPGA (U100.B3), USB2.0 (U800.23)
USB_FD6: FPGA (U100.C5), USB2.0 (U800.24)
USB_FD7: FPGA (U100.A4), USB2.0 (U800.25)
USB_FD8: FPGA (U100.C8), USB2.0 (U800.45)
USB_FD9: FPGA (U100.A7), USB2.0 (U800.46)
USB_FD10: FPGA (U100.B6), USB2.0 (U800.47)
USB_FD11: FPGA (U100.A6), USB2.0 (U800.48)
USB_FD12: FPGA (U100.C10), USB2.0 (U800.49)
USB_FD13: FPGA (U100.D11), USB2.0 (U800.50)
USB_FD14: FPGA (U100.B12), USB2.0 (U800.51)
USB_FD15: FPGA (U100.C11), USB2.0 (U800.52)
USB_FIFOADR0: FPGA (U100.A9), USB2.0 (U800.37)
USB_FIFOADR1: FPGA (U100.B8), USB2.0 (U800.38)
USB_FLAGA: FPGA (U100.B4), USB2.0 (U800.29)
USB_FLAGB: FPGA (U100.A5), USB2.0 (U800.30)
USB_FLAGC: FPGA (U100.C7), USB2.0 (U800.31)
USB_PKTEND: FPGA (U100.B9), USB2.0 (U800.39)
USB_SLCS: FPGA (U100.A11), USB2.0 (U800.40)
USB_SLOE: FPGA (U100.A8), USB2.0 (U800.35)
USB_SLRD: FPGA (U100.B11), USB2.0 (U800.1)
USB_SLWR: FPGA (U100.A10), USB2.0 (U800.2)
VGA_VS: FPGA (U100.M13), VGA (R2.1)
WE_N: FPGA (U100.E3), DDR3 RAM (R219.2 U200.L3)